# Altium project PCB_FM_SHUM.PrjPcb
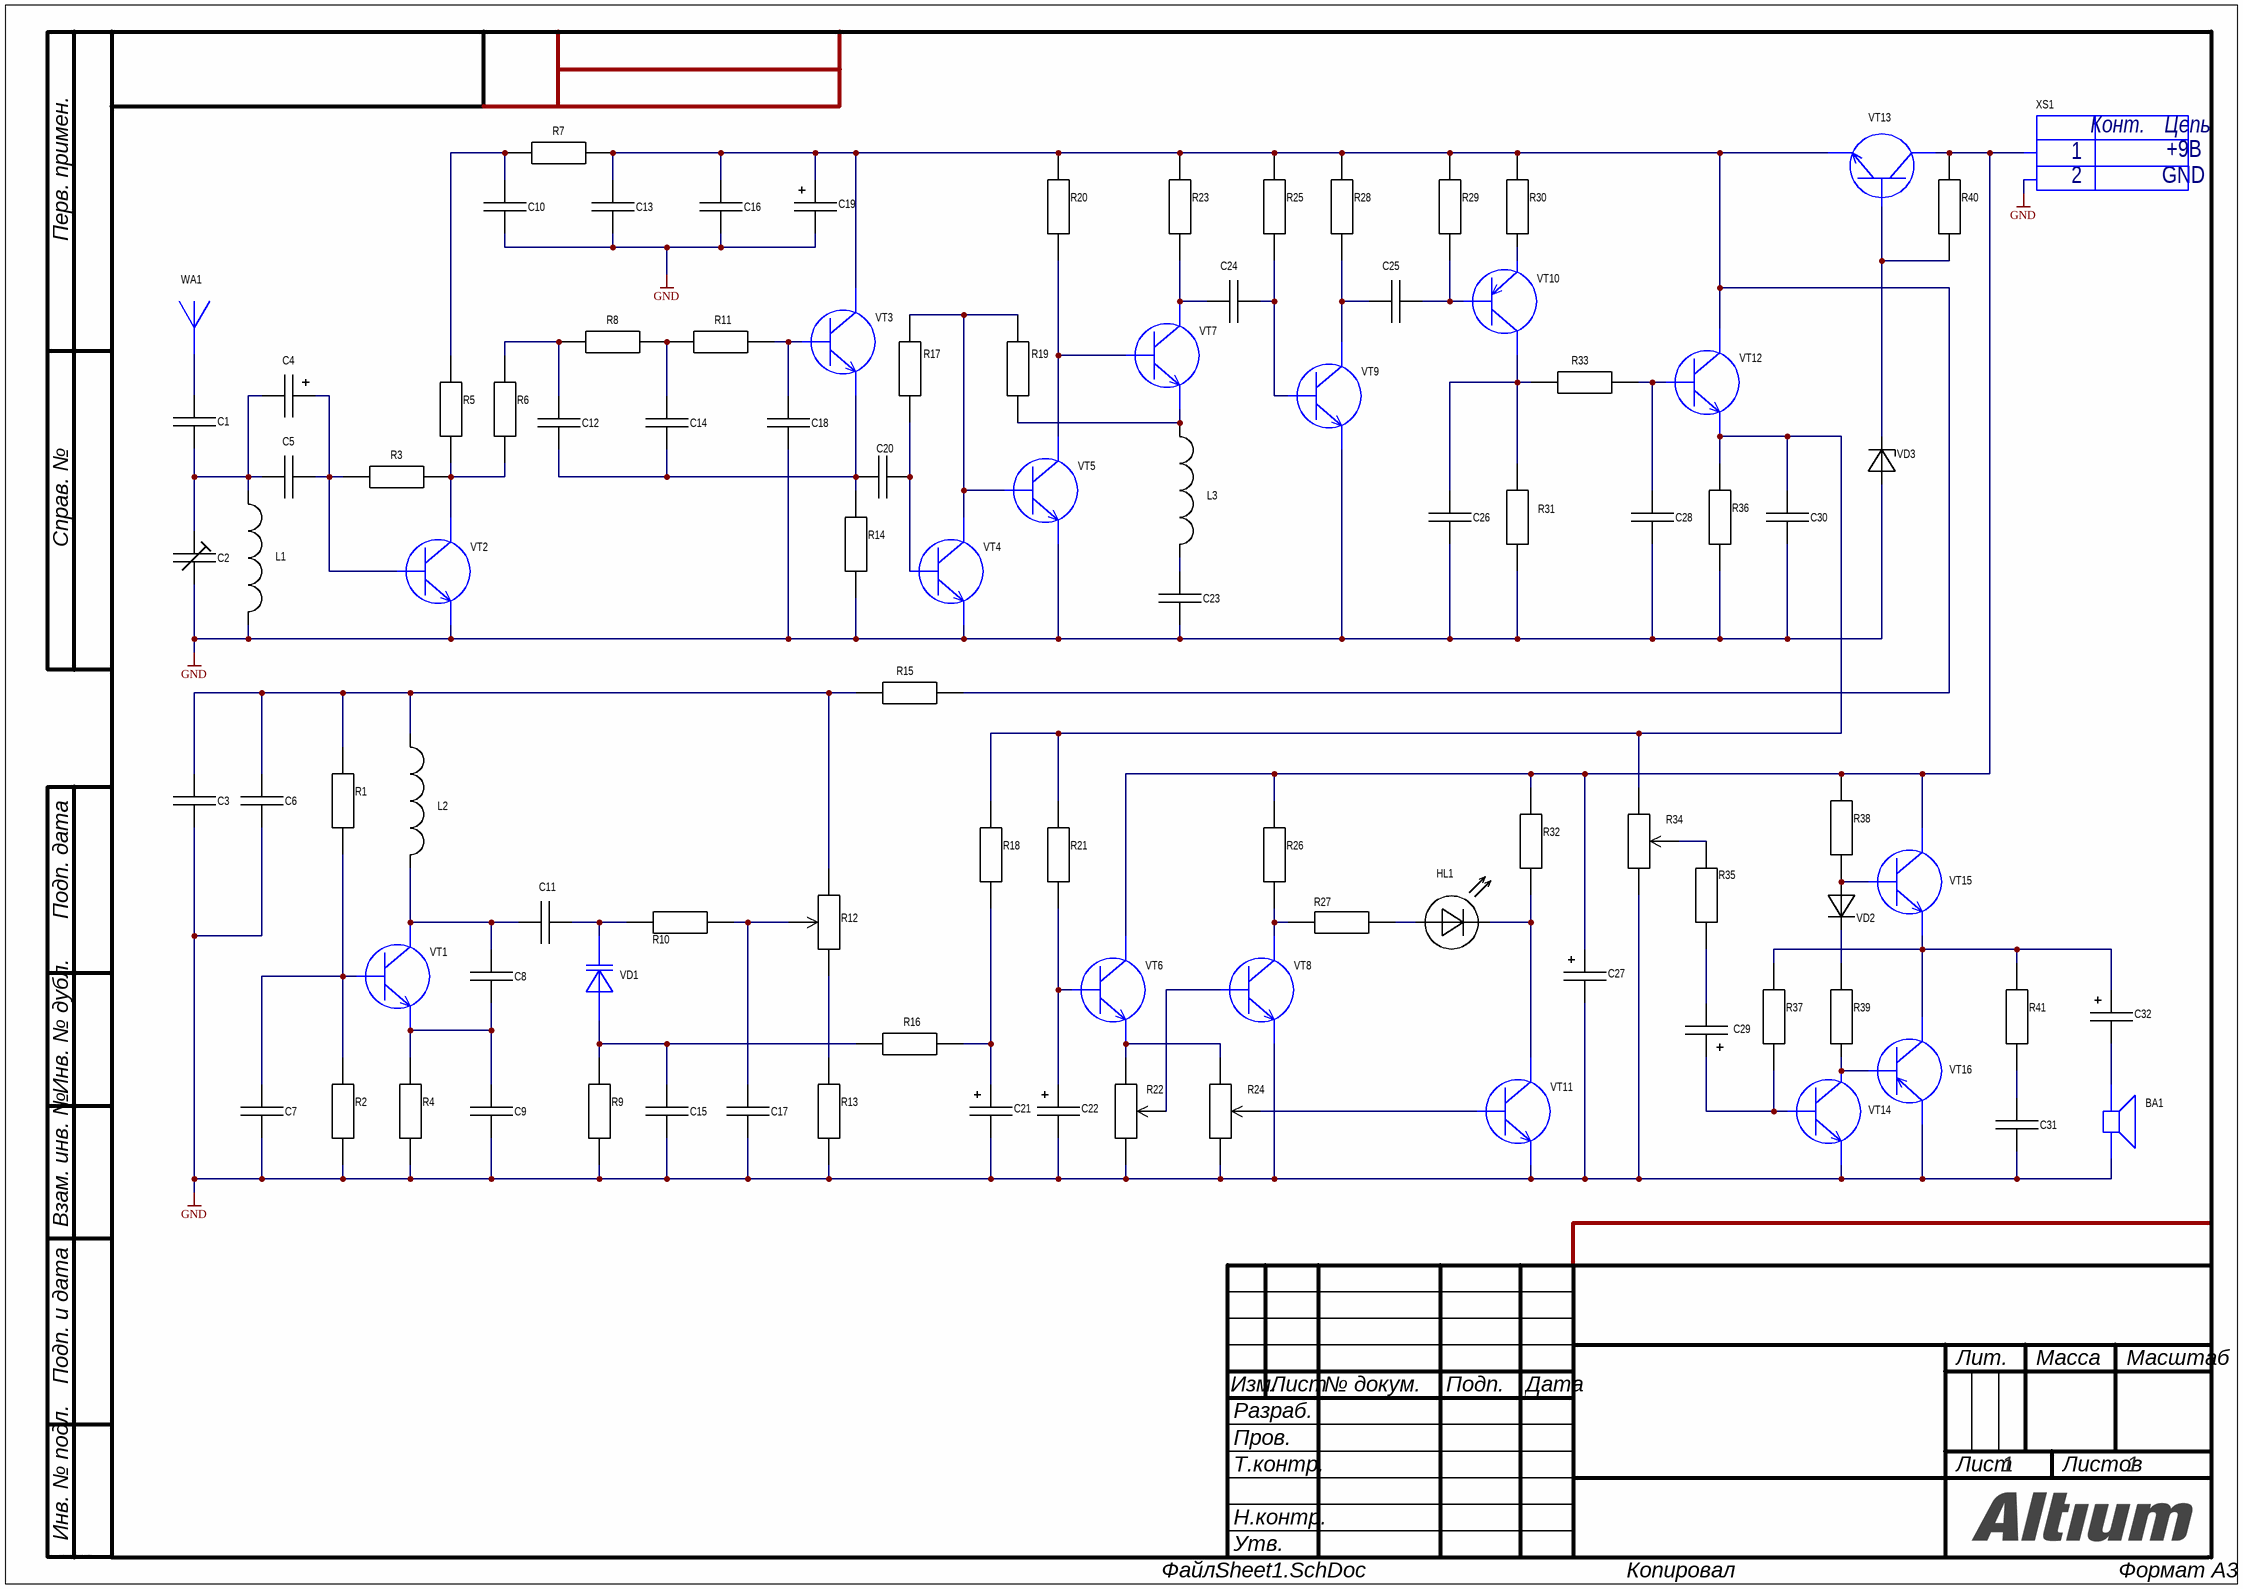
[diagram p0: Sheet1.SchDoc]
1 sheet, 99 parts. Net scope: global (net labels, ports and power ports of the same name join across sheets).
Board file: PCB1.PcbDoc

## Sheet Sheet1.SchDoc
size 420 x 297 mm; SheetNumber: 1; SheetTotal: 1

### Parts
BA1  speaker  (value not drawn)
C1  15pF  [CAP-0805]  (value not drawn)
C2  Cap_rated  [CAP-RATED]  (value not drawn)
C3  100nF  [CAP-0805]  (value not drawn)
C4  10uF  [CAP-SMD-A]  (value not drawn)
C5  100nF  [CAP-0805]  (value not drawn)
C6  100nF  [CAP-0805]  (value not drawn)
C7  10nF  [CAP-0805]  (value not drawn)
C8  8pF  [CAP-0805]  (value not drawn)
C9  47pF  [CAP-0805]  (value not drawn)
C10  100nF  [CAP-0805]  (value not drawn)
C11  1nF  [CAP-0805]  (value not drawn)
C12  47pF  [CAP-0805]  (value not drawn)
C13  100nF  [CAP-0805]  (value not drawn)
C14  47pF  [CAP-0805]  (value not drawn)
C15  100nF  [CAP-0805]  (value not drawn)
C16  100nF  [CAP-0805]  (value not drawn)
C17  100nF  [CAP-0805]  (value not drawn)
C18  47pF  [CAP-0805]  (value not drawn)
C19  220uF  [CAP-SMD-A]  (value not drawn)
C20  5.1nF  [CAP-0805]  (value not drawn)
C21  10uF  [CAP-SMD-A]  (value not drawn)
C22  10uF  [CAP-SMD-A]  (value not drawn)
C23  15nF  [CAP-0805]  (value not drawn)
C24  22nF  [CAP-0805]  (value not drawn)
C25  39pF  [CAP-0805]  (value not drawn)
C26  1nF  [CAP-0805]  (value not drawn)
C27  220uF  [CAP-SMD-A]  (value not drawn)
C28  3.3nF  [CAP-0805]  (value not drawn)
C29  10uF  [CAP-SMD-A]  (value not drawn)
C30  3.3nF  [CAP-0805]  (value not drawn)
C31  100nF  [CAP-0805]  (value not drawn)
C32  220uF  [CAP-SMD-A]  (value not drawn)
HL1  LED white  [LED_RED_5MM]  (value not drawn)
L1  Inductor coil  [INDUCTOR-AXIS]  (value not drawn)
L2  Inductor coil  [INDUCTOR-AXIS]  (value not drawn)
L3  Inductor coil  [INDUCTOR-AXIS]  (value not drawn)
R1  15k  [RES-0805]  (value not drawn)
R2  5.1k  [RES-0805]  (value not drawn)
R3  220k  [RES-0805]  (value not drawn)
R4  470  [RES-0805]  (value not drawn)
R5  2k  [RES-0805]  (value not drawn)
R6  6.8k  [RES-0805]  (value not drawn)
R7  1k  [RES-0805]  (value not drawn)
R8  6.8k  [RES-0805]  (value not drawn)
R9  8.2k  [RES-0805]  (value not drawn)
R10  100k  [RES-0805]  (value not drawn)
R11  6.8k  [RES-0805]  (value not drawn)
R12  22k  [RES-POT-3296W]  (value not drawn)
R13  1k  [RES-0805]  (value not drawn)
R14  3.3k  [RES-0805]  (value not drawn)
R15  150  [RES-0805]  (value not drawn)
R16  51k  [RES-0805]  (value not drawn)
R17  1.5k  [RES-0805]  (value not drawn)
R18  100k  [RES-0805]  (value not drawn)
R19  2k  [RES-0805]  (value not drawn)
R20  6.8k  [RES-0805]  (value not drawn)
R21  100k  [RES-0805]  (value not drawn)
R22  6.8k  [RES-POT-3]  (value not drawn)
R23  1.8k  [RES-0805]  (value not drawn)
R24  6.8k  [RES-POT-3]  (value not drawn)
R25  51k  [RES-0805]  (value not drawn)
R26  4.7k  [RES-0805]  (value not drawn)
R27  1k  [RES-0805]  (value not drawn)
R28  4.7k  [RES-0805]  (value not drawn)
R29  4.7k  [RES-0805]  (value not drawn)
R30  220  [RES-0805]  (value not drawn)
R31  8.2k  [RES-0805]  (value not drawn)
R32  4.7k  [RES-0805]  (value not drawn)
R33  18k  [RES-0805]  (value not drawn)
R34  10k  [RES-POT-2]  (value not drawn)
R35  4.7k  [RES-0805]  (value not drawn)
R36  3k  [RES-0805]  (value not drawn)
R37  150k  [RES-0805]  (value not drawn)
R38  750  [RES-0805]  (value not drawn)
R39  47  [RES-0805]  (value not drawn)
R40  HrenzZnaet(470)  [RES-0805]  (value not drawn)
R41  10  [RES-0805]  (value not drawn)
VD1  didoe  [DIODE-AXIS]  (value not drawn)
VD2  1N4148W  [SOD-123]  (value not drawn)
VD3  BZV55C6V8  [DIODE-MELF]  (value not drawn)
VT1  SS9018  [SOT-23-3]  (value not drawn)
VT2  SS9018  [SOT-23-3]  (value not drawn)
VT3  ВС847  [SOT-23-3]  (value not drawn)
VT4  ВС847  [SOT-23-3]  (value not drawn)
VT5  ВС847  [SOT-23-3]  (value not drawn)
VT6  ВС847  [SOT-23-3]  (value not drawn)
VT7  ВС847  [SOT-23-3]  (value not drawn)
VT8  ВС847  [SOT-23-3]  (value not drawn)
VT9  ВС847  [SOT-23-3]  (value not drawn)
VT10  BC857  [SOT-23-3]  (value not drawn)
VT11  ВС847  [SOT-23-3]  (value not drawn)
VT12  ВС847  [SOT-23-3]  (value not drawn)
VT13  ВС847  [SOT-23-3]  (value not drawn)
VT14  ВС847  [SOT-23-3]  (value not drawn)
VT15  BCP56  [SOT-223]  (value not drawn)
VT16  BCP53  [SOT-223]  (value not drawn)
WA1  Antenna  (value not drawn)
XS1  Connection2  [Power socket]  (value not drawn)

### Nets
GND: BA1.1 C2.1 C3.1 C6.1 C7.1 C9.1 C10.1 C13.1 C15.1 C16.1 C17.1 C18.1 C19.C C21.C C22.C C23.2 C26.2 C27.C C28.2 C30.2 C31.2 L1.2 R2.2 R4.2 R9.2 R13.1 R14.1 R22.2 R24.2 R31.2 R34.2 R36.2 VD3.A VT2.2(Э) VT4.2(Э) VT5.2(Э) VT8.2(Э) VT9.2(Э) VT11.2(Э) VT14.2(Э) VT16.3(Э) XS1.G
NetBA1_0: BA1.0 C32.C
NetC1_1: C1.1 WA1.1
NetC1_2: C1.2 C2.2 C4.C C5.1 L1.1
NetC3_2: C3.2 C6.2 L2.1 R1.1 R12.2 R15.2
NetC4_A: C4.A C5.2 R3.2 VT2.1(Б)
NetC7_2: C7.2 R1.2 R2.1 VT1.1(Б)
NetC8_1: C8.1 C9.2 R4.1 VT1.2(Э)
NetC8_2: C8.2 C11.2 L2.2 VT1.3(К)
NetC10_2: C10.2 R5.2 R7.1
NetC11_1: C11.1 R10.1 VD1.C(К)
NetC12_1: C12.1 C14.1 C20.2 R14.2 VT3.2(Э)
NetC12_2: C12.2 R6.1 R8.2
NetC13_2: C13.2 C16.2 C19.A R7.2 R15.1 R20.1 R23.1 R25.1 R28.1 R29.1 R30.1 VT3.3(К) VT12.3(К) VT13.2(Э)
NetC14_2: C14.2 R8.1 R11.1
NetC15_2: C15.2 R9.1 R16.2 VD1.A(А)
NetC17_2: C17.2 R10.2 R12.3
NetC18_2: C18.2 R11.2 VT3.1(Б)
NetC20_1: C20.1 R17.1 VT4.1(Б)
NetC21_A: C21.A R16.1 R18.2
NetC22_A: C22.A R21.2 VT6.1(Б)
NetC23_1: C23.1 L3.2
NetC24_1: C24.1 R25.2 VT9.1(Б)
NetC24_2: C24.2 R23.2 VT7.3(К)
NetC25_1: C25.1 R29.2 VT10.1(Б)
NetC25_2: C25.2 R28.2 VT9.3(К)
NetC26_1: C26.1 R31.1 R33.2 VT10.3(К)
NetC27_A: C27.A R26.1 R32.1 R38.2 R40.1 VT6.3(К) VT13.3(К) VT15.2(К) XS1.V
NetC28_1: C28.1 R33.1 VT12.1(Б)
NetC29_A: C29.A R37.2 VT14.1(Б)
NetC29_C: C29.C R35.1
NetC30_1: C30.1 R18.1 R21.1 R34.1 R36.1 VT12.2(Э)
NetC31_1: C31.1 R41.1
NetC32_A: C32.A R37.1 R41.2 VT15.3(Э) VT16.2(К)
NetHL1_1: HL1.1 R27.2
NetHL1_2: HL1.2 R32.2 VT11.3(К)
NetL3_1: L3.1 R19.2 VT7.2(Э)
NetR3_1: R3.1 R5.1 R6.2 VT2.3(К)
NetR12_1: R12.1 R13.2
NetR17_2: R17.2 R19.1 VT4.3(К) VT5.1(Б)
NetR20_2: R20.2 VT5.3(К) VT7.1(Б)
NetR22_1: R22.1 R24.1 VT6.2(Э)
NetR22_3: R22.3 VT8.1(Б)
NetR24_3: R24.3 VT11.1(Б)
NetR26_2: R26.2 R27.1 VT8.3(К)
NetR30_2: R30.2 VT10.2(Э)
NetR34_3: R34.3 R35.2
NetR38_1: R38.1 VD2.A VT15.1(Б)
NetR39_1: R39.1 VT14.3(К) VT16.1(Б)
NetR39_2: R39.2 VD2.C
NetR40_2: R40.2 VD3.C VT13.1(Б)

### Notes on the sheet
- Перв. примен.
- Справ. №
- Подп. дата
- Инв. № дубл.
- Взам. инв. №
- Подп. и дата
- Изм.
- Разраб.
- Лист
- № докум.
- Подп.
- Дата
- Лит.
- Масса
- Масштаб
- Пров.
- Т.контр.
- Листов
- Инв. № подл.
- Н.контр.
- Утв.
- ALTIUM GOSTBOM2.0 KEV
- Файл:
- Копировал
- Формат А3
- (in symbol Connection2) Конт.; Цепь; +9В; GND

### Library data of the parts
C1 C3 C5-C18 C20 C23-C26 C28 C30 C31 = Cap
C4 C19 C21 C22 C27 C29 C32 = Cap_polar
HL1 = Led_1
R1-R11 R13-R21 R23 R25-R33 R35-R41 = resistor
R12 R22 R24 R34 = POT
VD2 = Diode
VD3 = Diode_stab
VT1-VT9 VT11-VT14 = NPN_1
VT10 = PNP_1
VT15 = NPN_2
VT16 = PNP_2